# Altium schematic sheet Power.SchDoc: PULP - shield - GAP
size A4; Revision: 1.1; SheetNumber: 2; SheetTotal: 2
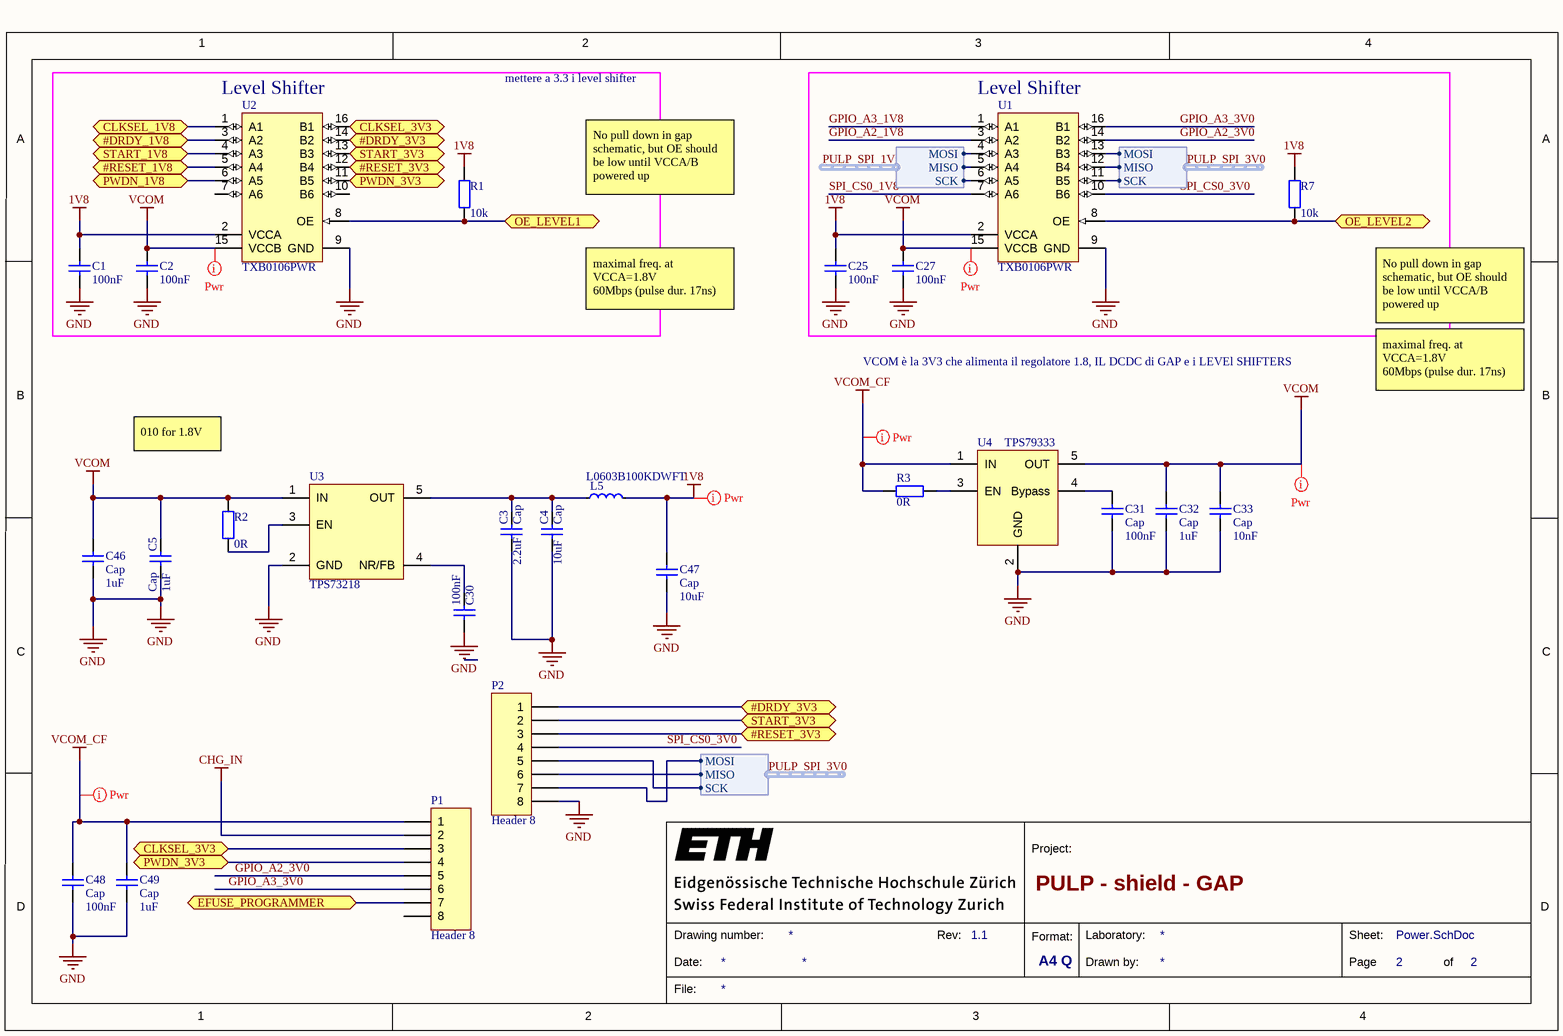
[diagram p0: Power.SchDoc]

## Parts
C1  100nF  [CAPC0402(1005)60_N]
C2  100nF  [CAPC0402(1005)60_N]
C3  Cap  value 2.2uF  [cap_0402_R - modified]
C4  Cap  value 10uF  [cap_0402_R - modified]
C5  Cap  value 1uF  [cap_0402_R - modified]
C25  100nF  [CAPC0402(1005)60_N]
C27  100nF  [CAPC0402(1005)60_N]
C30  value 100nF  [cap_0402_R - modified]  (hidden comment: C)
C31  Cap  value 100nF  [cap_0402_R - modified]
C32  Cap  value 1uF  [cap_0402_R - modified]
C33  Cap  value 10nF  [cap_0402_R - modified]
C46  Cap  value 1uF  [CAPC0402(1005)60_N]
C47  Cap  value 10uF  [CAPC0402(1005)60_N]
C48  Cap  value 100nF  [cap_0402_R - modified]
C49  Cap  value 1uF  [cap_0402_R - modified]
L5  L0603B100KDWFT  [SMD 0805_A]
P1  Header 8  [HDR1X8]
P2  Header 8  [HDR1X8]
R1  value 10k  [cap_0402_R - modified]  (hidden comment: R)
R2  value 0R  [cap_0402_R - modified]  (hidden comment: R)
R3  value 0R  [cap_0402_R - modified]  (hidden comment: R)
R7  value 10k  [cap_0402_R - modified]  (hidden comment: R)
U1  TXB0106PWR  [PW0016A_L]
U2  TXB0106PWR  [PW0016A_L]
U3  TPS73218  [SOT23__DDC__(R - PDSO-  G5)]
U4  TPS79333  [SOT_23__DBV_(R - PDSO - G5)]

## Blocks framed on the sheet
Level Shifter: C1 C2 R1 U2
Level Shifter: C25 C27 R7 U1

## Ports
#DRDY_1V8, #DRDY_3V3, #RESET_1V8, #RESET_3V3, CLKSEL_1V8, CLKSEL_3V3, EFUSE_PROGRAMMER, OE_LEVEL1, OE_LEVEL2, PWDN_1V8, PWDN_3V3, START_1V8, START_3V3

## Harnesses
SPI: SCK, MISO, MOSI

## Nets
1V8: C1.2 C25.2 C47.2 L5.2 R1.2 R7.2 U1.2(VCCA) U2.2(VCCA)
CHG_IN: P1.2
GND: C1.1 C2.2 C3.2 C4.2 C5.2 C25.1 C27.2 C30.2 C31.1 C32.2 C33.1 C46.1 C47.1 C48.1 C49.2 P2.8 U1.9(GND) U2.9(GND) U3.2(GND) U4.2(GND)
VCOM: C2.1 C5.1 C27.1 C32.1 C33.2 C46.2 R2.2 U1.15(VCCB) U2.15(VCCB) U3.1(IN) U4.5(OUT)
VCOM_CF: C48.2 C49.1 P1.1 R3.2 U4.1(IN)
#DRDY_1V8: U2.3(A2) ; port #DRDY_1V8
#DRDY_3V3: P2.1 U2.14(B2) ; port #DRDY_3V3
#RESET_1V8: U2.5(A4) ; port #RESET_1V8
#RESET_3V3: P2.3 U2.12(B4) ; port #RESET_3V3
CLKSEL_1V8: U2.1(A1) ; port CLKSEL_1V8
CLKSEL_3V3: P1.3 U2.16(B1) ; port CLKSEL_3V3
EFUSE_PROGRAMMER: P1.7 ; port EFUSE_PROGRAMMER
GPIO_A2_1V8: U1.3(A2)
GPIO_A2_3V0: P1.5 U1.14(B2)
GPIO_A3_1V8: U1.1(A1)
GPIO_A3_3V0: P1.6 U1.16(B1)
OE_LEVEL1: R1.1 U2.8(OE) ; port OE_LEVEL1
OE_LEVEL2: R7.1 U1.8(OE) ; port OE_LEVEL2
PULP_SPI_1V8.MISO: U1.5(A4) ; harness SPI.MISO
PULP_SPI_1V8.MOSI: U1.4(A3) ; harness SPI.MOSI
PULP_SPI_1V8.SCK: U1.6(A5) ; harness SPI.SCK
PULP_SPI_3V0.MISO: P2.6 U1.12(B4) ; harness SPI.MISO
PULP_SPI_3V0.MOSI: P2.7 U1.13(B3) ; harness SPI.MOSI
PULP_SPI_3V0.SCK: P2.5 U1.11(B5) ; harness SPI.SCK
PWDN_1V8: U2.6(A5) ; port PWDN_1V8
PWDN_3V3: P1.4 U2.11(B5) ; port PWDN_3V3
SPI_CS0_1V8: U1.7(A6)
SPI_CS0_3V0: P2.4 U1.10(B6)
START_1V8: U2.4(A3) ; port START_1V8
START_3V3: P2.2 U2.13(B3) ; port START_3V3
NetC3_1: C3.1 C4.1 L5.1 U3.5(OUT)
NetC30_1: C30.1 U3.4(NR/FB)
NetC31_2: C31.2 U4.4(Bypass)
NetR2_1: R2.1 U3.3(EN)
NetR3_1: R3.1 U4.3(EN)

Not connected (* = marked no-connect by the designer): P1 8; U2 7(A6) 10(B6)

## Layout directives
net class POWER: 1V8, VCOM, VCOM_CF

## Notes on the sheet
- mettere a 3.3 i level shifter
- No pull down in gap schematic, but OE should be low until VCCA/B powered up
- maximal freq. at VCCA=1.8V
  60Mbps (pulse dur. 17ns)
- VCOM è la 3V3 che alimenta il regolatore 1.8, IL DCDC di GAP e i LEVEl SHIFTERS
- 010 for 1.8V
- 1
- 2
- 3
- 4
- A
- B
- C
- Project:
- D
- Date:
- Drawing number:
- Rev:
- Format:
- A4 Q
- Drawn by:
- Laboratory:
- Page
- Sheet:
- of
- File:

## Library data of the parts
C1 C2 C25 C27 = CMP-1034-02065-1: CAP 100nF 10V ±10% 0402 (1005 Metric) Thickness 0.6mm SMD; Case-EIA: 0402; Case-Metric: 1005; Tolerance: Â±10%; Max Thickness: 0.6 mm; Value: 100nF; Rated Voltage: 10 V; Technology: SMT
C3-C5 C30-C33 C46-C49 = Cap: Capacitor; Published: 8-Jun-2000; LatestRevisionDate: 17-Jul-2002; LatestRevisionNote: Re-released for DXP Platform.; PackageReference: RAD-0.3; Publisher: Altium Limited; PackageDescription: Radial Cap, Thru-Hole; 2 Leads; 0.3 in Pin Spacing
L5 = IND: Power Multilayer Inductor WE-PMI, L=2.20 µH; Part Number: L0603-10µ; Manufacturer: Taiyo Yuden; Manufacturer Part Number: LBMF1608T100K; 2nd source part number: 178-6105; Value: 2.2µH; Note: LBMF1608T100K 10µH 80mA 0603; Artikkelnr Noca: 33029314; Artikkelnr Simpro: N.A.; Datasheet: http://www.yuden.co.jp/ut/product/pdf/elb2_e.pdf; LatestRevisionDate: 2012-09-19; Pin Count: 2; Publisher: Nordic Semiconductor; Published: 2010-02-24; Supplier: Digi-Key; Supplier part number: 587-1714-1-ND; 2nd source Supplier: Farnell; Footprint Doc: Power Multilayer Inductor WE-PMI, L=2.20 µH
P1 P2 = Header 8: Header, 8-Pin; LatestRevisionDate: 17-Jul-2002; LatestRevisionNote: Re-released for DXP Platform.; Publisher: Altium Limited
R1-R3 R7 = Res2: Resistor; Published: 8-Jun-2000; LatestRevisionDate: 17-Jul-2002; LatestRevisionNote: Re-released for DXP Platform.; PackageReference: AXIAL-0.4; Publisher: Altium Limited; PackageDescription: Axial Device, Thru-Hole; 2 Leads; 0.4 in Pin Spacing
U1 U2 = TI-TXB0106-TSSOP_PW-16: 6-Bit Bidirectional Level-Shifting and Voltage Translator with Auto-Direction Sensing and +/- 15-kV ESD Protection, 1.2 to 3.6 V, -40 to 85 degC, 16-Pin TSSOP (PW), Green (RoHS & no Sb/Br), Tape and Reel; Manufacturer: Texas Instruments; Dynamic Catalog: TXBSeries; Differential - Input: Output:No/No; Number of Bits: 6; Output Type: Logic; Propagation Delay (Max): 4ns; Number of Outputs/Channel: 1; Voltage - Supply: 1.2V~3.6V,1.65V~5.5V; Data Rate: 100Mbps; Product Training Modules: VoltageLevelTranslation; Other Names: 296-23759-1; Logic Function: Translator,Bidirectional; Packaging: CutTape(CT); Datasheet URL: http://www.ti.com/general/docs/lit/getliterature.tsp?genericPartNumber=TXB0106&fileType=pdf; Package Description: 16-Pin Small Outline Package Integrated Circuit, Body 5 x 4.4 mm, Pitch 0.65 mm; Standard Package: 1; Series: -; Manufacturer URL: http://www.ti.com/; Operating Temperature: -40°C~85°C; Supplier Device Package: 16-TSSOP; Package Reference: PW16; Number of Channels: 6; Category: IntegratedCircuits(ICs); Package / Case: 16-TSSOP(0.173",4.40mmWidth); Family: Logic-Translators; Datasheet Version: Rev. B, 06/2015; Mounting Technology: SurfaceMount; Input Type: Logic
U3 = TPS73225: Linear Regulator
U4 = TPS79333: Regulator